# Altium schematic sheet Encoder - 32 bit.SchDoc
size A4
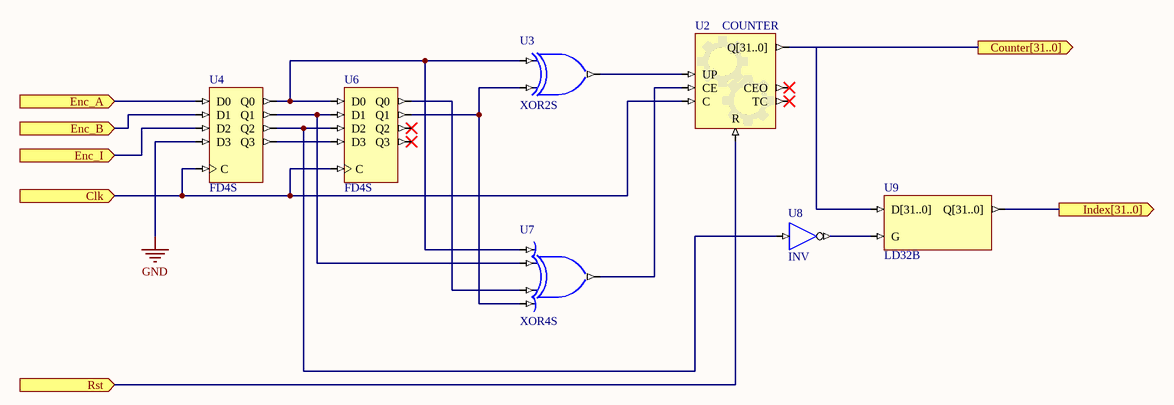
[diagram p0: Encoder - 32 bit.SchDoc]

## Parts
U2  COUNTER
U3  XOR2S
U4  FD4S
U6  FD4S
U7  XOR4S
U8  INV
U9  LD32B

## Ports
Clk (in), Counter[31..0] (out), Enc_A (in), Enc_B (in), Enc_I (in), Index[31..0] (out), Rst (in)

## Nets
GND: U4.D3
Clk: U2.C U4.C U6.C ; port Clk
Counter[31..0]: U2.Q[31..0] U9.D[31..0] ; port Counter[31..0]
Enc_A: U4.D0 ; port Enc_A
Enc_B: U4.D1 ; port Enc_B
Enc_I: U4.D2 ; port Enc_I
Index[31..0]: U9.Q[31..0] ; port Index[31..0]
Rst: U2.R ; port Rst
NetU2_CE: U2.CE U7.O
NetU2_UP: U2.UP U3.O
NetU3_I0: U3.I0 U4.Q0 U6.D0 U7.I0
NetU3_I1: U3.I1 U6.Q1 U7.I3
NetU4_Q1: U4.Q1 U6.D1 U7.I1
NetU4_Q2: U4.Q2 U6.D2 U8.I
NetU4_Q3: U4.Q3 U6.D3
NetU6_Q0: U6.Q0 U7.I2
NetU8_O: U8.O U9.G

Not connected (* = marked no-connect by the designer): U2 CEO* TC*; U6 Q2* Q3*

## Library data of the parts
U2 = COUNTER: Configurable Counter; ConfiguratorName: GENERIC_COUNTER; ConfigurationParameters: {}Version[1.0]{}Type[Binary]{}SyncReset[True]{}NegativeClockEdge[False]{}FixedDirection[False]{}IsIncrement[False]{}SignalWidth[32]{}MaxValue[4294967295]{}BusOutput[True]{}Loadable[False]{}BusInput[False]{}; LastRevisionNo: 1.00.00; Published: 14-Jan-2009; Publisher: Altium Limited
U3 = XOR2: 2-Input Exclusive-OR Gate, Single Pin Version; XilinxEquivalent: XOR2; FunctionalClass: Logic Primitive; SubClass: XOR; PortSize: 2; ArchiveName: GENERIC; VHDLIB_SIM: GENERIC_LIB; Published: 29-Jan-2004; Publisher: Altium Limited; LastRevisionNo: 1.00.00; HelpURL: CR0118 FPGA Generic Library Guide.pdf#page=448; ComponentLink1URL: CR0136 FPGA Logic Primitive Resource Usage.pdf#page=301; ComponentLink1Description: Core &Resource Usage; PortStyle: Single Pin Version
U4 U6 = FD4S: 4-Bit D-Type Flip-Flop, Single Pin Version; XilinxEquivalent: FD4; SubClass: FD; ClockTrigger: Rising; PortSize: 4; ArchiveName: GENERIC; VHDLIB_SIM: GENERIC_LIB; Published: 29-Jan-2004; Publisher: Altium Limited; LastRevisionNo: 1.00.00; HelpURL: CR0118 FPGA Generic Library Guide.pdf#page=170; ComponentLink1URL: CR0133 FPGA Flip Flop Resource Usage.pdf#page=60; ComponentLink1Description: Core &Resource Usage; FunctionalClass: Flip-Flop; PortStyle: Single Pin Version
U7 = XOR4: 4-Input Exclusive-OR Gate, Single Pin Version; XilinxEquivalent: XOR4; FunctionalClass: Logic Primitive; SubClass: XOR; PortSize: 4; ArchiveName: GENERIC; VHDLIB_SIM: GENERIC_LIB; Published: 29-Jan-2004; Publisher: Altium Limited; LastRevisionNo: 1.00.00; HelpURL: CR0118 FPGA Generic Library Guide.pdf#page=448; ComponentLink1URL: CR0136 FPGA Logic Primitive Resource Usage.pdf#page=319; ComponentLink1Description: Core &Resource Usage; PortStyle: Single Pin Version
U8 = INV: Inverter; FunctionalClass: Logic Primitive; ArchiveName: GENERIC; VHDLIB_SIM: GENERIC_LIB; Published: 29-Jan-2004; Publisher: Altium Limited; XilinxEquivalent: INV; LastRevisionNo: 1.00.00; HelpURL: CR0118 FPGA Generic Library Guide.pdf#page=291; ComponentLink1URL: CR0136 FPGA Logic Primitive Resource Usage.pdf#page=61; ComponentLink1Description: Core &Resource Usage; SubClass: INV
U9 = LD32B: 32-Bit Transparent Data Latch, Bus Version; PortSize: 32; ArchiveName: GENERIC; VHDLIB_SIM: GENERIC_LIB; Published: 31-May-2004; Publisher: Altium Limited; LastRevisionNo: 1.00.00; HelpURL: CR0118 FPGA Generic Library Guide.pdf#page=310; ComponentLink1URL: CR0135 FPGA Latch Resource Usage.pdf#page=21; ComponentLink1Description: Core &Resource Usage; FunctionalClass: Latch; PortStyle: Bus Version